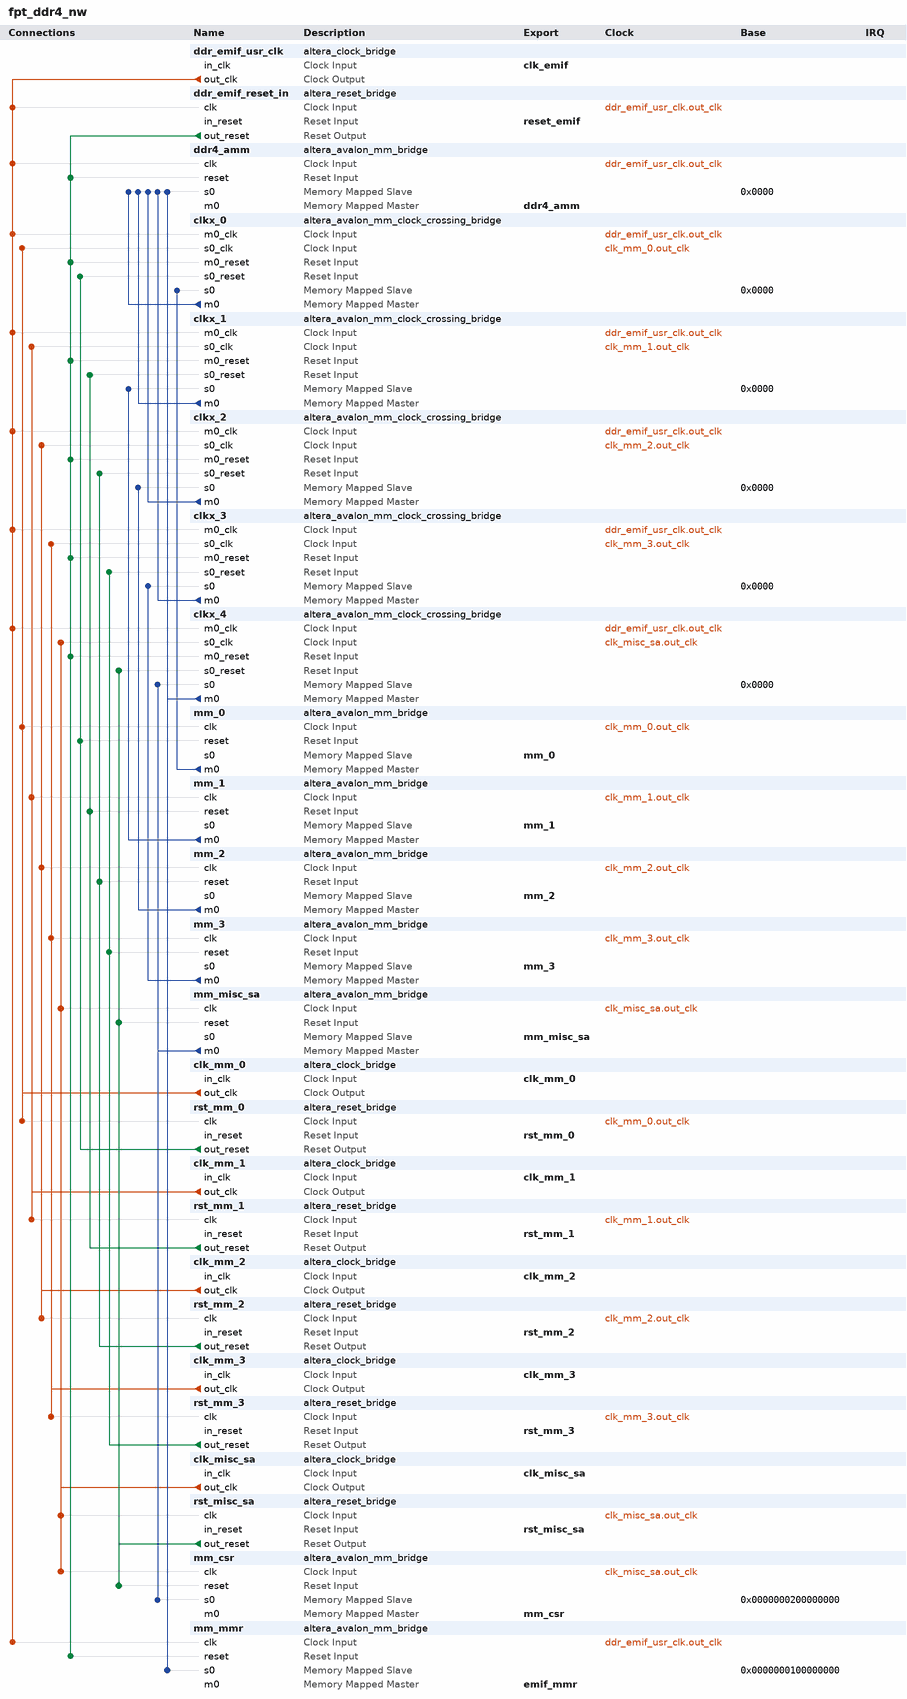
[diagram p0: system contents]
# Platform Designer (Qsys) system fpt_ddr4_nw, Stratix 10 1SG280LU3F50E1VG
# Parameters at their usual value, and those the tool derives, are not listed.
package require -exact qsys 1.0
create_system fpt_ddr4_nw
set_project_property DEVICE_FAMILY {Stratix 10}
set_project_property DEVICE 1SG280LU3F50E1VG

add_component ddr_emif_usr_clk ip/fpt_ddr4_nw/fpt_ddr4_nw_clock_in.ip altera_clock_bridge ddr_emif_usr_clk 19.2.0
load_component ddr_emif_usr_clk
set_component_parameter_value DERIVED_CLOCK_RATE 0
set_component_parameter_value EXPLICIT_CLOCK_RATE 50000000
save_component

add_component ddr_emif_reset_in ip/fpt_ddr4_nw/fpt_ddr4_nw_reset_in.ip altera_reset_bridge ddr_emif_reset_in 19.2.0
load_component ddr_emif_reset_in
set_component_parameter_value ACTIVE_LOW_RESET 1
set_component_parameter_value SYNCHRONOUS_EDGES deassert
set_component_parameter_value SYNC_RESET 0
save_component

add_component ddr4_amm ip/fpt_ddr4_nw/fpt_ddr4_nw_mm_bridge_0.ip altera_avalon_mm_bridge ddr4_amm 20.0.0
load_component ddr4_amm
set_component_parameter_value DATA_WIDTH 512
set_component_parameter_value ADDRESS_WIDTH 26
set_component_parameter_value USE_AUTO_ADDRESS_WIDTH 0
set_component_parameter_value ADDRESS_UNITS WORDS
set_component_parameter_value MAX_BURST_SIZE 64
set_component_parameter_value MAX_PENDING_RESPONSES 4
set_component_parameter_value MAX_PENDING_WRITES 0
set_component_parameter_value SYNC_RESET 0
set_component_parameter_value USE_WRITERESPONSE 0
save_component

add_component clkx_0 ip/fpt_ddr4_nw/fpt_ddr4_nw_mm_clock_crossing_bridge_0.ip altera_avalon_mm_clock_crossing_bridge clkx_0 19.2.0
load_component clkx_0
set_component_parameter_value DATA_WIDTH 256
set_component_parameter_value ADDRESS_WIDTH 32
set_component_parameter_value USE_AUTO_ADDRESS_WIDTH 0
set_component_parameter_value MAX_BURST_SIZE 8
set_component_parameter_value COMMAND_FIFO_DEPTH 128
set_component_parameter_value RESPONSE_FIFO_DEPTH 128
set_component_parameter_value MASTER_SYNC_DEPTH 2
set_component_parameter_value SLAVE_SYNC_DEPTH 2
set_component_parameter_value SYNC_RESET 0
save_component

add_component clkx_1 ip/fpt_ddr4_nw/clkx_1.ip altera_avalon_mm_clock_crossing_bridge clkx_1 19.2.0
load_component clkx_1
set_component_parameter_value DATA_WIDTH 256
set_component_parameter_value ADDRESS_WIDTH 32
set_component_parameter_value USE_AUTO_ADDRESS_WIDTH 0
set_component_parameter_value MAX_BURST_SIZE 8
set_component_parameter_value COMMAND_FIFO_DEPTH 128
set_component_parameter_value RESPONSE_FIFO_DEPTH 128
set_component_parameter_value MASTER_SYNC_DEPTH 2
set_component_parameter_value SLAVE_SYNC_DEPTH 2
set_component_parameter_value SYNC_RESET 0
save_component

add_component clkx_2 ip/fpt_ddr4_nw/clkx_2.ip altera_avalon_mm_clock_crossing_bridge clkx_2 19.2.0
load_component clkx_2
set_component_parameter_value DATA_WIDTH 256
set_component_parameter_value ADDRESS_WIDTH 32
set_component_parameter_value USE_AUTO_ADDRESS_WIDTH 0
set_component_parameter_value MAX_BURST_SIZE 8
set_component_parameter_value COMMAND_FIFO_DEPTH 128
set_component_parameter_value RESPONSE_FIFO_DEPTH 128
set_component_parameter_value MASTER_SYNC_DEPTH 2
set_component_parameter_value SLAVE_SYNC_DEPTH 2
set_component_parameter_value SYNC_RESET 0
save_component

add_component clkx_3 ip/fpt_ddr4_nw/clkx_3.ip altera_avalon_mm_clock_crossing_bridge clkx_3 19.2.0
load_component clkx_3
set_component_parameter_value DATA_WIDTH 256
set_component_parameter_value ADDRESS_WIDTH 32
set_component_parameter_value USE_AUTO_ADDRESS_WIDTH 0
set_component_parameter_value MAX_BURST_SIZE 8
set_component_parameter_value COMMAND_FIFO_DEPTH 128
set_component_parameter_value RESPONSE_FIFO_DEPTH 128
set_component_parameter_value MASTER_SYNC_DEPTH 2
set_component_parameter_value SLAVE_SYNC_DEPTH 2
set_component_parameter_value SYNC_RESET 0
save_component

add_component clkx_4 ip/fpt_ddr4_nw/fpt_ddr4_nw_mm_clock_crossing_bridge_1.ip altera_avalon_mm_clock_crossing_bridge clkx_4 19.2.0
load_component clkx_4
set_component_parameter_value DATA_WIDTH 32
set_component_parameter_value ADDRESS_WIDTH 33
set_component_parameter_value USE_AUTO_ADDRESS_WIDTH 0
set_component_parameter_value MAX_BURST_SIZE 1
set_component_parameter_value COMMAND_FIFO_DEPTH 4
set_component_parameter_value RESPONSE_FIFO_DEPTH 4
set_component_parameter_value MASTER_SYNC_DEPTH 2
set_component_parameter_value SLAVE_SYNC_DEPTH 2
set_component_parameter_value SYNC_RESET 0
save_component

add_component mm_0 ip/fpt_ddr4_nw/ddr4_amm_0.ip altera_avalon_mm_bridge mm_0 20.0.0
load_component mm_0
set_component_parameter_value DATA_WIDTH 256
set_component_parameter_value ADDRESS_WIDTH 32
set_component_parameter_value USE_AUTO_ADDRESS_WIDTH 0
set_component_parameter_value ADDRESS_UNITS SYMBOLS
set_component_parameter_value MAX_BURST_SIZE 8
set_component_parameter_value MAX_PENDING_RESPONSES 4
set_component_parameter_value MAX_PENDING_WRITES 0
set_component_parameter_value SYNC_RESET 0
set_component_parameter_value USE_WRITERESPONSE 0
save_component

add_component mm_1 ip/fpt_ddr4_nw/mm_1.ip altera_avalon_mm_bridge mm_1 20.0.0
load_component mm_1
set_component_parameter_value DATA_WIDTH 256
set_component_parameter_value ADDRESS_WIDTH 32
set_component_parameter_value USE_AUTO_ADDRESS_WIDTH 0
set_component_parameter_value ADDRESS_UNITS SYMBOLS
set_component_parameter_value MAX_BURST_SIZE 8
set_component_parameter_value MAX_PENDING_RESPONSES 4
set_component_parameter_value MAX_PENDING_WRITES 0
set_component_parameter_value SYNC_RESET 0
set_component_parameter_value USE_WRITERESPONSE 0
save_component

add_component mm_2 ip/fpt_ddr4_nw/mm_2.ip altera_avalon_mm_bridge mm_2 20.0.0
load_component mm_2
set_component_parameter_value DATA_WIDTH 256
set_component_parameter_value ADDRESS_WIDTH 32
set_component_parameter_value USE_AUTO_ADDRESS_WIDTH 0
set_component_parameter_value ADDRESS_UNITS SYMBOLS
set_component_parameter_value MAX_BURST_SIZE 8
set_component_parameter_value MAX_PENDING_RESPONSES 4
set_component_parameter_value MAX_PENDING_WRITES 0
set_component_parameter_value SYNC_RESET 0
set_component_parameter_value USE_WRITERESPONSE 0
save_component

add_component mm_3 ip/fpt_ddr4_nw/mm_3.ip altera_avalon_mm_bridge mm_3 20.0.0
load_component mm_3
set_component_parameter_value DATA_WIDTH 256
set_component_parameter_value ADDRESS_WIDTH 32
set_component_parameter_value USE_AUTO_ADDRESS_WIDTH 0
set_component_parameter_value ADDRESS_UNITS SYMBOLS
set_component_parameter_value MAX_BURST_SIZE 8
set_component_parameter_value MAX_PENDING_RESPONSES 4
set_component_parameter_value MAX_PENDING_WRITES 0
set_component_parameter_value SYNC_RESET 0
set_component_parameter_value USE_WRITERESPONSE 0
save_component

add_component mm_misc_sa ip/fpt_ddr4_nw/mm_4.ip altera_avalon_mm_bridge mm_misc_sa 20.0.0
load_component mm_misc_sa
set_component_parameter_value DATA_WIDTH 256
set_component_parameter_value ADDRESS_WIDTH 34
set_component_parameter_value USE_AUTO_ADDRESS_WIDTH 0
set_component_parameter_value ADDRESS_UNITS SYMBOLS
set_component_parameter_value MAX_BURST_SIZE 8
set_component_parameter_value MAX_PENDING_RESPONSES 4
set_component_parameter_value MAX_PENDING_WRITES 0
set_component_parameter_value SYNC_RESET 0
set_component_parameter_value USE_WRITERESPONSE 0
save_component

add_component clk_mm_0 ip/fpt_ddr4_nw/ddr_emif_usr_clk_0.ip altera_clock_bridge clk_mm_0 19.2.0
load_component clk_mm_0
set_component_parameter_value DERIVED_CLOCK_RATE 0
set_component_parameter_value EXPLICIT_CLOCK_RATE 50000000
save_component

add_component rst_mm_0 ip/fpt_ddr4_nw/ddr_emif_reset_in_1.ip altera_reset_bridge rst_mm_0 19.2.0
load_component rst_mm_0
set_component_parameter_value ACTIVE_LOW_RESET 1
set_component_parameter_value SYNCHRONOUS_EDGES deassert
set_component_parameter_value SYNC_RESET 0
save_component

add_component clk_mm_1 ip/fpt_ddr4_nw/clk_mm_1.ip altera_clock_bridge clk_mm_1 19.2.0
load_component clk_mm_1
set_component_parameter_value DERIVED_CLOCK_RATE 0
set_component_parameter_value EXPLICIT_CLOCK_RATE 50000000
save_component

add_component rst_mm_1 ip/fpt_ddr4_nw/rst_mm_1.ip altera_reset_bridge rst_mm_1 19.2.0
load_component rst_mm_1
set_component_parameter_value ACTIVE_LOW_RESET 1
set_component_parameter_value SYNCHRONOUS_EDGES deassert
set_component_parameter_value SYNC_RESET 0
save_component

add_component clk_mm_2 ip/fpt_ddr4_nw/clk_mm_2.ip altera_clock_bridge clk_mm_2 19.2.0
load_component clk_mm_2
set_component_parameter_value DERIVED_CLOCK_RATE 0
set_component_parameter_value EXPLICIT_CLOCK_RATE 50000000
save_component

add_component rst_mm_2 ip/fpt_ddr4_nw/rst_mm_2.ip altera_reset_bridge rst_mm_2 19.2.0
load_component rst_mm_2
set_component_parameter_value ACTIVE_LOW_RESET 1
set_component_parameter_value SYNCHRONOUS_EDGES deassert
set_component_parameter_value SYNC_RESET 0
save_component

add_component clk_mm_3 ip/fpt_ddr4_nw/clk_mm_3.ip altera_clock_bridge clk_mm_3 19.2.0
load_component clk_mm_3
set_component_parameter_value DERIVED_CLOCK_RATE 0
set_component_parameter_value EXPLICIT_CLOCK_RATE 50000000
save_component

add_component rst_mm_3 ip/fpt_ddr4_nw/rst_mm_3.ip altera_reset_bridge rst_mm_3 19.2.0
load_component rst_mm_3
set_component_parameter_value ACTIVE_LOW_RESET 1
set_component_parameter_value SYNCHRONOUS_EDGES deassert
set_component_parameter_value SYNC_RESET 0
save_component

add_component clk_misc_sa ip/fpt_ddr4_nw/clk_mm_4.ip altera_clock_bridge clk_misc_sa 19.2.0
load_component clk_misc_sa
set_component_parameter_value DERIVED_CLOCK_RATE 0
set_component_parameter_value EXPLICIT_CLOCK_RATE 50000000
save_component

add_component rst_misc_sa ip/fpt_ddr4_nw/rst_mm_4.ip altera_reset_bridge rst_misc_sa 19.2.0
load_component rst_misc_sa
set_component_parameter_value ACTIVE_LOW_RESET 1
set_component_parameter_value SYNCHRONOUS_EDGES deassert
set_component_parameter_value SYNC_RESET 0
save_component

add_component mm_csr ip/fpt_ddr4_nw/mm_5.ip altera_avalon_mm_bridge mm_csr 20.0.0
load_component mm_csr
set_component_parameter_value DATA_WIDTH 32
set_component_parameter_value ADDRESS_WIDTH 11
set_component_parameter_value USE_AUTO_ADDRESS_WIDTH 0
set_component_parameter_value ADDRESS_UNITS SYMBOLS
set_component_parameter_value MAX_BURST_SIZE 8
set_component_parameter_value MAX_PENDING_RESPONSES 4
set_component_parameter_value MAX_PENDING_WRITES 0
set_component_parameter_value SYNC_RESET 0
set_component_parameter_value USE_WRITERESPONSE 0
save_component

add_component mm_mmr ip/fpt_ddr4_nw/mm_csr_0.ip altera_avalon_mm_bridge mm_mmr 20.0.0
load_component mm_mmr
set_component_parameter_value DATA_WIDTH 32
set_component_parameter_value ADDRESS_WIDTH 10
set_component_parameter_value USE_AUTO_ADDRESS_WIDTH 0
set_component_parameter_value ADDRESS_UNITS WORDS
set_component_parameter_value MAX_PENDING_RESPONSES 4
set_component_parameter_value MAX_PENDING_WRITES 0
set_component_parameter_value SYNC_RESET 0
set_component_parameter_value USE_WRITERESPONSE 0
save_component

# connections
add_connection clk_misc_sa.out_clk clkx_4.s0_clk clock
add_connection clk_misc_sa.out_clk mm_csr.clk clock
add_connection clk_misc_sa.out_clk mm_misc_sa.clk clock
add_connection clk_misc_sa.out_clk rst_misc_sa.clk clock
add_connection clk_mm_0.out_clk clkx_0.s0_clk clock
add_connection clk_mm_0.out_clk mm_0.clk clock
add_connection clk_mm_0.out_clk rst_mm_0.clk clock
add_connection clk_mm_1.out_clk clkx_1.s0_clk clock
add_connection clk_mm_1.out_clk mm_1.clk clock
add_connection clk_mm_1.out_clk rst_mm_1.clk clock
add_connection clk_mm_2.out_clk clkx_2.s0_clk clock
add_connection clk_mm_2.out_clk mm_2.clk clock
add_connection clk_mm_2.out_clk rst_mm_2.clk clock
add_connection clk_mm_3.out_clk clkx_3.s0_clk clock
add_connection clk_mm_3.out_clk mm_3.clk clock
add_connection clk_mm_3.out_clk rst_mm_3.clk clock
add_connection ddr_emif_usr_clk.out_clk clkx_0.m0_clk clock
add_connection ddr_emif_usr_clk.out_clk clkx_1.m0_clk clock
add_connection ddr_emif_usr_clk.out_clk clkx_2.m0_clk clock
add_connection ddr_emif_usr_clk.out_clk clkx_3.m0_clk clock
add_connection ddr_emif_usr_clk.out_clk clkx_4.m0_clk clock
add_connection ddr_emif_usr_clk.out_clk ddr4_amm.clk clock
add_connection ddr_emif_usr_clk.out_clk ddr_emif_reset_in.clk clock
add_connection ddr_emif_usr_clk.out_clk mm_mmr.clk clock
add_connection ddr_emif_reset_in.out_reset clkx_0.m0_reset reset
add_connection ddr_emif_reset_in.out_reset clkx_1.m0_reset reset
add_connection ddr_emif_reset_in.out_reset clkx_2.m0_reset reset
add_connection ddr_emif_reset_in.out_reset clkx_3.m0_reset reset
add_connection ddr_emif_reset_in.out_reset clkx_4.m0_reset reset
add_connection ddr_emif_reset_in.out_reset ddr4_amm.reset reset
add_connection ddr_emif_reset_in.out_reset mm_mmr.reset reset
add_connection rst_misc_sa.out_reset clkx_4.s0_reset reset
add_connection rst_misc_sa.out_reset mm_csr.reset reset
add_connection rst_misc_sa.out_reset mm_misc_sa.reset reset
add_connection rst_mm_0.out_reset clkx_0.s0_reset reset
add_connection rst_mm_0.out_reset mm_0.reset reset
add_connection rst_mm_1.out_reset clkx_1.s0_reset reset
add_connection rst_mm_1.out_reset mm_1.reset reset
add_connection rst_mm_2.out_reset clkx_2.s0_reset reset
add_connection rst_mm_2.out_reset mm_2.reset reset
add_connection rst_mm_3.out_reset clkx_3.s0_reset reset
add_connection rst_mm_3.out_reset mm_3.reset reset
add_connection clkx_0.m0 ddr4_amm.s0 avalon
set_connection_parameter_value clkx_0.m0/ddr4_amm.s0 baseAddress 0x0000
add_connection clkx_1.m0 ddr4_amm.s0 avalon
set_connection_parameter_value clkx_1.m0/ddr4_amm.s0 baseAddress 0x0000
add_connection clkx_2.m0 ddr4_amm.s0 avalon
set_connection_parameter_value clkx_2.m0/ddr4_amm.s0 baseAddress 0x0000
add_connection clkx_3.m0 ddr4_amm.s0 avalon
set_connection_parameter_value clkx_3.m0/ddr4_amm.s0 baseAddress 0x0000
add_connection clkx_4.m0 ddr4_amm.s0 avalon
set_connection_parameter_value clkx_4.m0/ddr4_amm.s0 baseAddress 0x0000
add_connection clkx_4.m0 mm_mmr.s0 avalon
set_connection_parameter_value clkx_4.m0/mm_mmr.s0 baseAddress 0x0000000100000000
add_connection mm_0.m0 clkx_0.s0 avalon
set_connection_parameter_value mm_0.m0/clkx_0.s0 baseAddress 0x0000
add_connection mm_1.m0 clkx_1.s0 avalon
set_connection_parameter_value mm_1.m0/clkx_1.s0 baseAddress 0x0000
add_connection mm_2.m0 clkx_2.s0 avalon
set_connection_parameter_value mm_2.m0/clkx_2.s0 baseAddress 0x0000
add_connection mm_3.m0 clkx_3.s0 avalon
set_connection_parameter_value mm_3.m0/clkx_3.s0 baseAddress 0x0000
add_connection mm_misc_sa.m0 clkx_4.s0 avalon
set_connection_parameter_value mm_misc_sa.m0/clkx_4.s0 baseAddress 0x0000
add_connection mm_misc_sa.m0 mm_csr.s0 avalon
set_connection_parameter_value mm_misc_sa.m0/mm_csr.s0 baseAddress 0x0000000200000000

# exported interfaces
add_interface clk_emif clock sink
set_interface_property clk_emif EXPORT_OF ddr_emif_usr_clk.in_clk
add_interface clk_misc_sa clock sink
set_interface_property clk_misc_sa EXPORT_OF clk_misc_sa.in_clk
add_interface clk_mm_0 clock sink
set_interface_property clk_mm_0 EXPORT_OF clk_mm_0.in_clk
add_interface clk_mm_1 clock sink
set_interface_property clk_mm_1 EXPORT_OF clk_mm_1.in_clk
add_interface clk_mm_2 clock sink
set_interface_property clk_mm_2 EXPORT_OF clk_mm_2.in_clk
add_interface clk_mm_3 clock sink
set_interface_property clk_mm_3 EXPORT_OF clk_mm_3.in_clk
add_interface ddr4_amm avalon master
set_interface_property ddr4_amm EXPORT_OF ddr4_amm.m0
add_interface emif_mmr avalon master
set_interface_property emif_mmr EXPORT_OF mm_mmr.m0
add_interface mm_0 avalon slave
set_interface_property mm_0 EXPORT_OF mm_0.s0
add_interface mm_1 avalon slave
set_interface_property mm_1 EXPORT_OF mm_1.s0
add_interface mm_2 avalon slave
set_interface_property mm_2 EXPORT_OF mm_2.s0
add_interface mm_3 avalon slave
set_interface_property mm_3 EXPORT_OF mm_3.s0
add_interface mm_csr avalon master
set_interface_property mm_csr EXPORT_OF mm_csr.m0
add_interface mm_misc_sa avalon slave
set_interface_property mm_misc_sa EXPORT_OF mm_misc_sa.s0
add_interface reset_emif reset sink
set_interface_property reset_emif EXPORT_OF ddr_emif_reset_in.in_reset
add_interface rst_misc_sa reset sink
set_interface_property rst_misc_sa EXPORT_OF rst_misc_sa.in_reset
add_interface rst_mm_0 reset sink
set_interface_property rst_mm_0 EXPORT_OF rst_mm_0.in_reset
add_interface rst_mm_1 reset sink
set_interface_property rst_mm_1 EXPORT_OF rst_mm_1.in_reset
add_interface rst_mm_2 reset sink
set_interface_property rst_mm_2 EXPORT_OF rst_mm_2.in_reset
add_interface rst_mm_3 reset sink
set_interface_property rst_mm_3 EXPORT_OF rst_mm_3.in_reset

save_system fpt_ddr4_nw.qsys
